# EAGLE schematic control_board_v006_Rev6 (EAGLE 6.6.0)
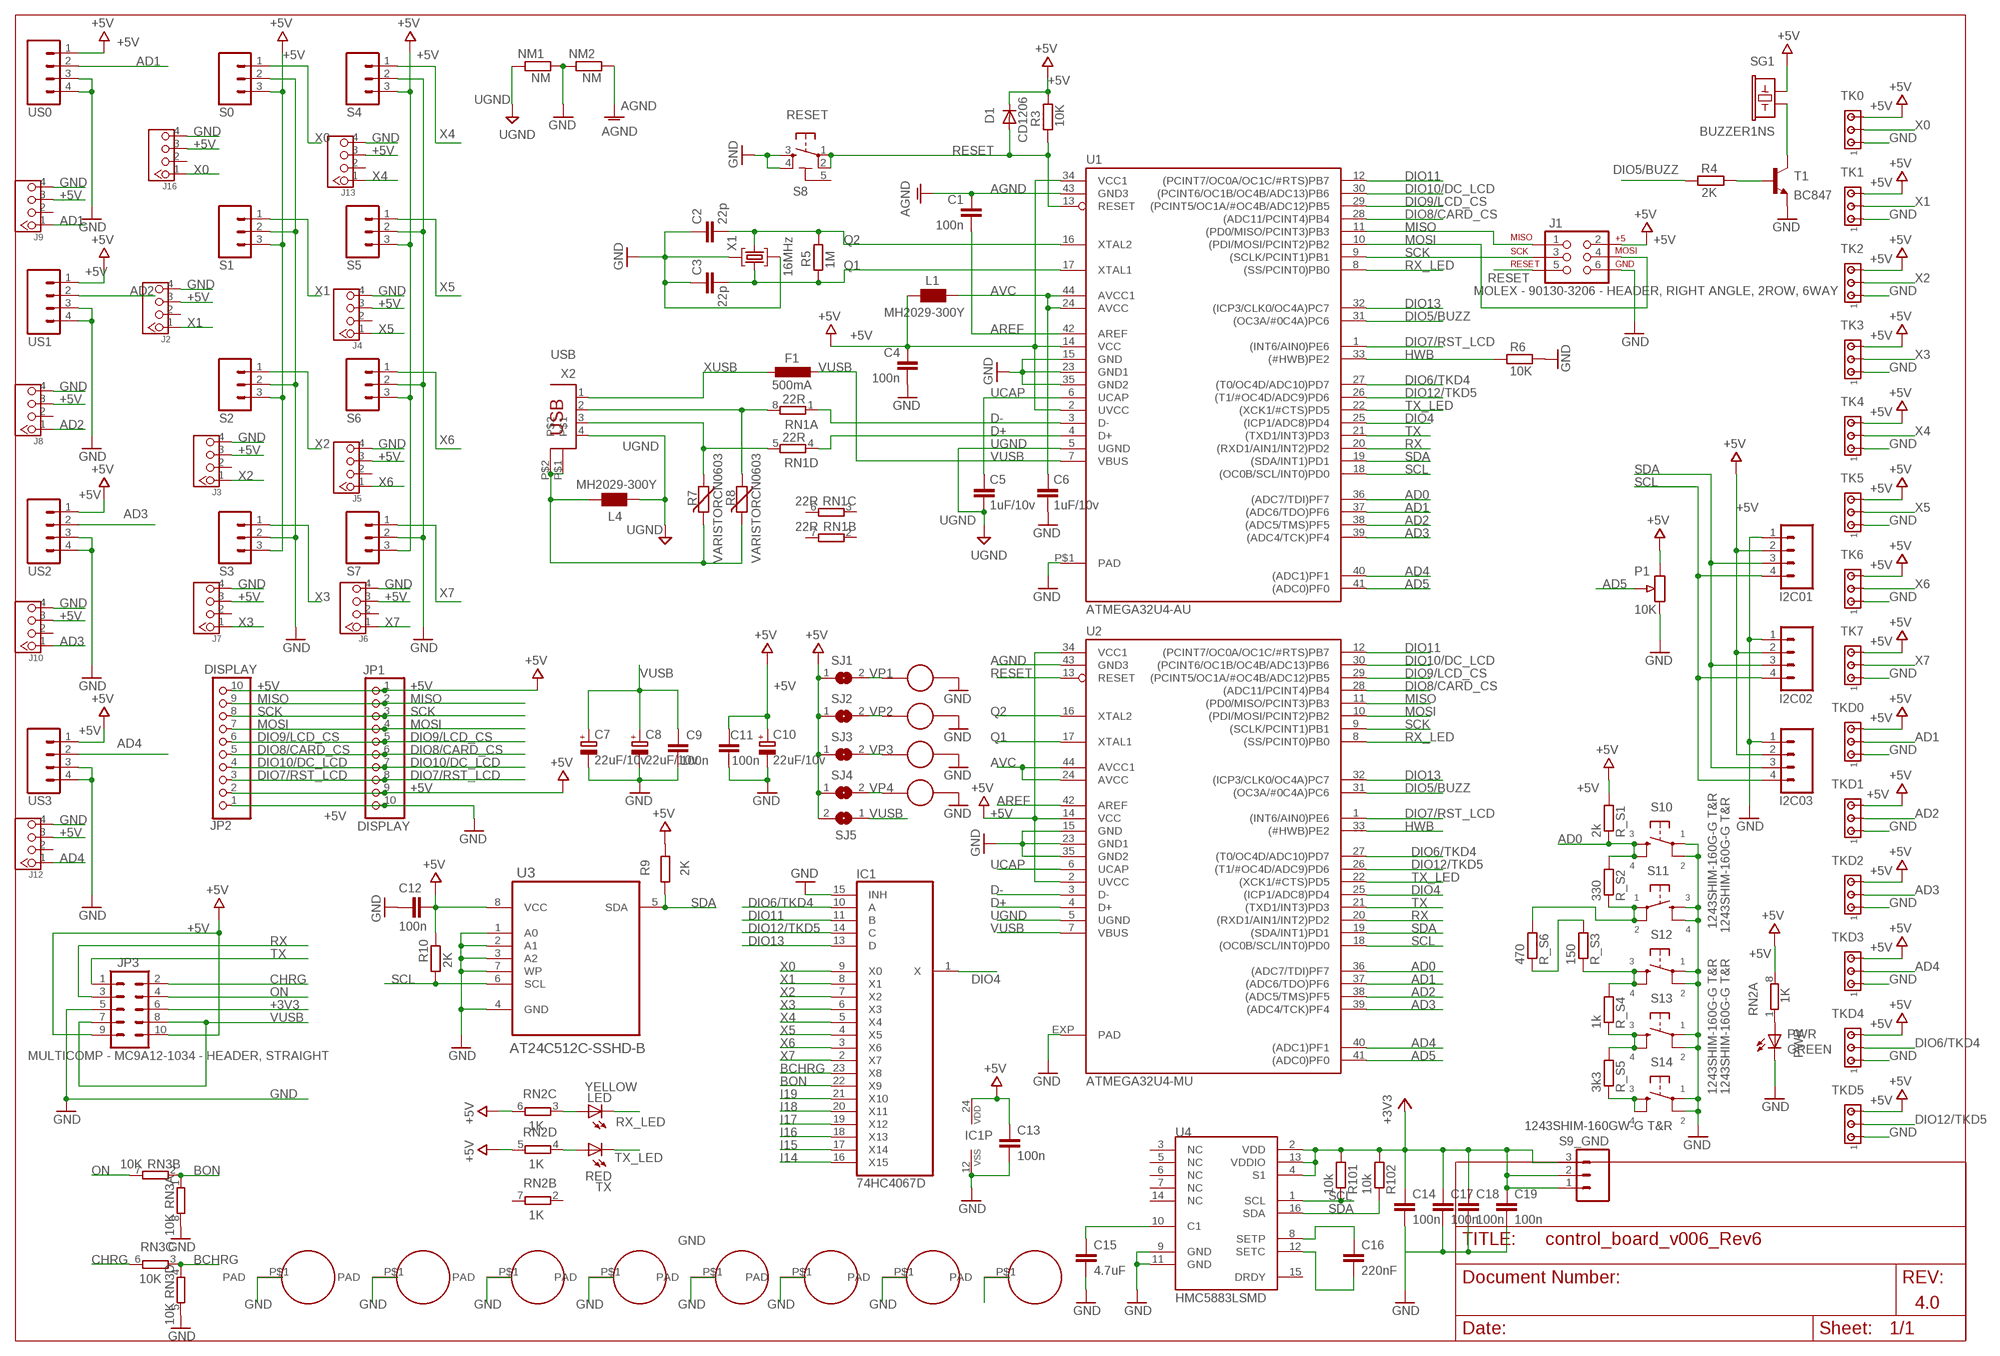
[diagram p0: schematic, sheet 1]

## Parts
C1  100n  C-EUC0603  [C0603-ROUND]
C2  22p  C-EUC0603  [C0603-ROUND]
C3  22p  C-EUC0603  [C0603-ROUND]
C4  100n  C-EUC0603  [C0603-ROUND]
C5  1uF/10v  C-EUC0603  [C0603-ROUND]
C6  1uF/10v  C-EUC0603  [C0603-ROUND]
C7  22uF/10v  CPOL-EUSMCB  [SMC_B]
C8  22uF/10v  CPOL-EUSMCB  [SMC_B]
C9  100n  C-EUC0603  [C0603-ROUND]
C10  22uF/10v  CPOL-EUSMCB  [SMC_B]
C11  100n  C-EUC0603  [C0603-ROUND]
C12  100n  C-EUC0603  [C0603-ROUND]
C13  100n  C-EUC0603  [C0603-ROUND]
C14  100n  C-EUC0603  [C0603-ROUND]
C15  4.7uF  C-EUC0603  [C0603-ROUND]
C16  220nF  C-EUC0603  [C0603-ROUND]
C17  100n  C-EUC0603  [C0603-ROUND]
C18  100n  C-EUC0603  [C0603-ROUND]
C19  100n  C-EUC0603  [C0603-ROUND]
D1  CD1206  DIODE-MINIMELF  [MINIMELF]
F1  500mA  L-EUL1812  [L1812]
H1  2.5-MOUNTING-HOLE  [2.5PAD]
H2  2.5-MOUNTING-HOLE  [2.5PAD]
H3  2.5-MOUNTING-HOLE  [2.5PAD]
H4  2.5-MOUNTING-HOLE  [2.5PAD]
H5  2.5-MOUNTING-HOLE  [2.5PAD]
H6  2.5-MOUNTING-HOLE  [2.5PAD]
H7  2.5-MOUNTING-HOLE  [2.5PAD]
H8  2.5-MOUNTING-HOLE  [2.5PAD]
I2C01  M04PTH  [1X04]
I2C02  M04PTH  [1X04]
I2C03  M04PTH  [1X04]
IC1  74HC4067D  4067D  [SO24W]
J1  MOLEX - 90130-3206 - HEADER, RIGHT ANGLE, 2ROW, 6WAY  AVR_SPI_PRG_6PTH  [2X3]
J2  TWIG-4P-2.0-2.0  [4P-2.0]
J3  TWIG-4P-2.0-2.0  [4P-2.0]
J4  TWIG-4P-2.0-2.0  [4P-2.0]
J5  TWIG-4P-2.0-2.0  [4P-2.0]
J6  TWIG-4P-2.0-2.0  [4P-2.0]
J7  TWIG-4P-2.0-2.0  [4P-2.0]
J8  TWIG-4P-2.0-2.0  [4P-2.0]
J9  TWIG-4P-2.0-2.0  [4P-2.0]
J10  TWIG-4P-2.0-2.0  [4P-2.0]
J12  TWIG-4P-2.0-2.0  [4P-2.0]
J13  TWIG-4P-2.0-2.0  [4P-2.0]
J16  TWIG-4P-2.0-2.0  [4P-2.0]
JP1  DISPLAY  PINHD-1X10TH  [1X10-TH]
JP2  DISPLAY  PINHD-1X10TH  [1X10-TH]
JP3  MULTICOMP - MC9A12-1034 - HEADER, STRAIGHT  M05X2SHD_LOCK  [2X5-SHROUDED_LOCK]
L1  MH2029-300Y  WE-CBF_0805  [0805]
L4  MH2029-300Y  WE-CBF_0805  [0805]
LED  YELLOW  LEDCHIP-LED0805  [CHIP-LED0805]
NM1  NM  R-EU_R0805  [R0805]
NM2  NM  R-EU_R0805  [R0805]
P1  10K  POT-VERTICAL  [POT-V]
PTZ1  LOTTIE_LEMON_PADS_SUP  [PADS_LOTTIE_LEMON_SUP]
PTZ2  LOTTIE_LEMON_PADS_SUP  [PADS_LOTTIE_LEMON_SUP]
PTZ3  LOTTIE_LEMON_PADS_SUP1  [PADS_LOTTIE_LEMON_SUP]
PTZ4  LOTTIE_LEMON_PADS_SUP1  [PADS_LOTTIE_LEMON_SUP]
PWR  PWR  LEDCHIP-LED0805  [CHIP-LED0805]
R3  10K  R-EU_R0603  [R0603-ROUND]
R4  2K  R-EU_R0603  [R0603-ROUND]
R5  1M  R-EU_R0603  [R0603-ROUND]
R6  10K  R-EU_R0603  [R0603-ROUND]
R7  VARISTORCN0603  [CT/CN0603]
R8  VARISTORCN0603  [CT/CN0603]
R9  2K  R-EU_R0603  [R0603-ROUND]
R10  2K  R-EU_R0603  [R0603-ROUND]
R101  10k  R-EU_R0603  [R0603-ROUND]
R102  10k  R-EU_R0603  [R0603-ROUND]
R_S1  2k  R-EU_R0603  [R0603-ROUND]
R_S2  330  R-EU_R0603  [R0603-ROUND]
R_S3  150  R-EU_R0603  [R0603-ROUND]
R_S4  1k  R-EU_R0603  [R0603-ROUND]
R_S5  3k3  R-EU_R0603  [R0603-ROUND]
R_S6  470  R-EU_R0603  [R0603-ROUND]
RN1  22R  4R-NCAY16  [CAY16]
RN2  1K  4R-NCAY16  [CAY16]
RN3  10K  4R-NCAY16  [CAY16]
S0  M03PTH  [1X03]
S1  M03PTH  [1X03]
S2  M03PTH  [1X03]
S3  M03PTH  [1X03]
S4  M03PTH  [1X03]
S5  M03PTH  [1X03]
S6  M03PTH  [1X03]
S7  M03PTH  [1X03]
S8  RESET  TS42  [TS42]
S9_GND  M03PTH  [1X03]
S10  1243SHIM-160G-G T&R  TACTILE_SWITCHTACTILE_SWITCH_SMD-12MM  [TACTILE-SMD-12MM]
S11  1243SHIM-160G-G T&R  TACTILE_SWITCHTACTILE_SWITCH_SMD-12MM  [TACTILE-SMD-12MM]
S12  1243SHIM-160G-G T&R  TACTILE_SWITCHTACTILE_SWITCH_SMD-12MM  [TACTILE-SMD-12MM]
S13  1243SHIM-160G-G T&R  TACTILE_SWITCHTACTILE_SWITCH_SMD-12MM  [TACTILE-SMD-12MM]
S14  1243SHIM-160GW-G T&R  TACTILE_SWITCHTACTILE_SWITCH_SMD-12MM  [TACTILE-SMD-12MM]
SG1  BUZZER1NS  [BUZZER-12MM-NS]
SJ1  SJ  [SJ]
SJ2  SJ  [SJ]
SJ3  SJ  [SJ]
SJ4  SJ  [SJ]
SJ5  SJL  [SJL]
T1  BC847  [SOT23]
TK0  MTA03-100  [10X03MTA]
TK1  MTA03-100  [10X03MTA]
TK2  MTA03-100  [10X03MTA]
TK3  MTA03-100  [10X03MTA]
TK4  MTA03-100  [10X03MTA]
TK5  MTA03-100  [10X03MTA]
TK6  MTA03-100  [10X03MTA]
TK7  MTA03-100  [10X03MTA]
TKD0  MTA03-100  [10X03MTA]
TKD1  MTA03-100  [10X03MTA]
TKD2  MTA03-100  [10X03MTA]
TKD3  MTA03-100  [10X03MTA]
TKD4  MTA03-100  [10X03MTA]
TKD5  MTA03-100  [10X03MTA]
TX  RED  LEDCHIP-LED0805  [CHIP-LED0805]
U1  ATMEGA32U4-AU  ATMEGA32U4-XUAU  [TQFP44-PAD]
U2  ATMEGA32U4-MU  ATMEGA32U4-XUMU  [QFN44ML7X7]
U3  AT24C512C-SSHD-B  AT24C128BN-SH-B  [SOIC127P600X175-8N]
U4  HMC5883LSMD  [16LPCC]
U$2  COMPLUBOT_LOTTIE_LEMON_BASE_TYPE002  [COMPLUBOT_BASE_ROBOT_002]
US0  M04PTH  [1X04]
US1  M04PTH  [1X04]
US2  M04PTH  [1X04]
US3  M04PTH  [1X04]
X1  16MHz  CRYSTAL-3.2-2.5  [CRYSTAL-3.2-2.5]
X2  USB  PN61729  [PN61729]

## Nets
+3V3: C14.1 C17.1 C18.1 C19.1 JP3.6 R101.2 R102.2 S9_GND.1 S9_GND.2 S9_GND.3 U4.2(VDD) U4.4(S1) U4.13(VDDIO)
+5V: C4.1 C10.+ C11.1 C12.1 C13.1 D1.C I2C01.2 I2C02.2 I2C03.2 IC1.24(VDD) J1.2 J2.3 J3.3 J4.3 J5.3 J6.3 J7.3 J8.3 J9.3 J10.3 J12.3 J13.3 J16.3 JP1.1 JP1.9 JP2.2 JP2.10 JP3.9 JP3.10 L1.2 P1.B R3.1 R9.2 R10.1 R_S1.2 RN2.5 RN2.6 RN2.8 S0.3 S1.3 S2.3 S3.3 S4.3 S5.3 S6.3 S7.3 SG1.+ SJ1.1 SJ2.1 SJ3.1 SJ4.1 SJ5.2 TK0.3 TK1.3 TK2.3 TK3.3 TK4.3 TK5.3 TK6.3 TK7.3 TKD0.3 TKD1.3 TKD2.3 TKD3.3 TKD4.3 TKD5.3 U1.2(UVCC) U1.14(VCC) U1.34(VCC1) U2.2(UVCC) U2.14(VCC) U2.34(VCC1) U3.8(VCC) US0.1 US1.1 US2.1 US3.1
AD0: R_S1.1 R_S2.2 S10.P$3 S10.P$4 U1.36((ADC7/TDI)PF7) U2.36((ADC7/TDI)PF7)
AD1: J9.1 TKD0.2 U1.37((ADC6/TDO)PF6) U2.37((ADC6/TDO)PF6) US0.2
AD2: J8.1 TKD1.2 U1.38((ADC5/TMS)PF5) U2.38((ADC5/TMS)PF5) US1.2
AD3: J10.1 TKD2.2 U1.39((ADC4/TCK)PF4) U2.39((ADC4/TCK)PF4) US2.2
AD4: J12.1 TKD3.2 U1.40((ADC1)PF1) U2.40((ADC1)PF1) US3.2
AD5: P1.C U1.41((ADC0)PF0) U2.41((ADC0)PF0)
AGND: C1.1 NM2.1 U1.43(GND3) U2.43(GND3)
AREF: C1.2 U1.42(AREF) U2.42(AREF)
AVC: C6.1 L1.1 U1.24(AVCC) U1.44(AVCC1) U2.24(AVCC) U2.44(AVCC1)
BCHRG: IC1.23(X8) RN3.3 RN3.4
BON: IC1.22(X9) RN3.1 RN3.2
CHRG: JP3.2 RN3.6
D+: RN1.4 U1.4(D+) U2.4(D+)
D-: RN1.1 U1.3(D-) U2.3(D-)
DIO4: IC1.1(X) U1.25((ICP1/ADC8)PD4) U2.25((ICP1/ADC8)PD4)
DIO5/BUZZ: R4.2 U1.31((OC3A/#0C4A)PC6) U2.31((OC3A/#0C4A)PC6)
DIO6/TKD4: IC1.10(A) TKD4.2 U1.27((T0/OC4D/ADC10)PD7) U2.27((T0/OC4D/ADC10)PD7)
DIO7/RST_LCD: JP1.8 JP2.3 U1.1((INT6/AIN0)PE6) U2.1((INT6/AIN0)PE6)
DIO8/CARD_CS: JP1.6 JP2.5 U1.28((ADC11/PCINT4)PB4) U2.28((ADC11/PCINT4)PB4)
DIO9/LCD_CS: JP1.5 JP2.6 U1.29((PCINT5/OC1A/#OC4B/ADC12)PB5) U2.29((PCINT5/OC1A/#OC4B/ADC12)PB5)
DIO10/DC_LCD: JP1.7 JP2.4 U1.30((PCINT6/OC1B/OC4B/ADC13)PB6) U2.30((PCINT6/OC1B/OC4B/ADC13)PB6)
DIO11: IC1.11(B) U1.12((PCINT7/OC0A/OC1C/#RTS)PB7) U2.12((PCINT7/OC0A/OC1C/#RTS)PB7)
DIO12/TKD5: IC1.14(C) TKD5.2 U1.26((T1/#OC4D/ADC9)PD6) U2.26((T1/#OC4D/ADC9)PD6)
DIO13: IC1.13(D) U1.32((ICP3/CLK0/OC4A)PC7) U2.32((ICP3/CLK0/OC4A)PC7)
GND: C2.1 C3.1 C4.2 C6.2 C7.- C8.- C9.2 C10.- C11.2 C12.2 C13.2 C14.2 C15.2 C17.2 C18.2 C19.2 H1.P$1(PAD) H2.P$1(PAD) H3.P$1(PAD) H4.P$1(PAD) H5.P$1(PAD) H6.P$1(PAD) H7.P$1(PAD) H8.P$1(PAD) I2C01.1 I2C02.1 I2C03.1 IC1.12(VSS) IC1.15(INH) J1.6 J2.4 J3.4 J4.4 J5.4 J6.4 J7.4 J8.4 J9.4 J10.4 J12.4 J13.4 J16.4 JP1.10 JP2.1 JP3.5 NM1.1 NM2.2 P1.A PTZ1.P$52 PTZ2.P$52 PTZ3.P$52 PTZ4.P$52 PWR.C R6.1 RN3.5 RN3.8 S0.2 S1.2 S2.2 S3.2 S4.2 S5.2 S6.2 S7.2 S8.3 S8.4 S10.P$1 S10.P$2 S11.P$3 S11.P$4 S12.P$1 S12.P$2 S13.P$1 S13.P$2 S14.P$1 S14.P$2 T1.2(E) TK0.1 TK1.1 TK2.1 TK3.1 TK4.1 TK5.1 TK6.1 TK7.1 TKD0.1 TKD1.1 TKD2.1 TKD3.1 TKD4.1 TKD5.1 U1.15(GND) U1.23(GND1) U1.35(GND2) U1.P$1(PAD) U2.15(GND) U2.23(GND1) U2.35(GND2) U2.EXP(PAD) U3.1(A0) U3.2(A1) U3.3(A2) U3.4(GND) U3.7(WP) U4.9(GND) U4.11(GND) US0.3 US0.4 US1.3 US1.4 US2.3 US2.4 US3.3 US3.4 X1.2(GND) X1.4(GND)
HWB: R6.2 U1.33((#HWB)PE2) U2.33((#HWB)PE2)
I14: IC1.16(X15)
I15: IC1.17(X14)
I16: IC1.18(X13)
I17: IC1.19(X12)
I18: IC1.20(X11)
I19: IC1.21(X10)
MISO: J1.1 JP1.2 JP2.9 U1.11((PD0/MISO/PCINT3)PB3) U2.11((PD0/MISO/PCINT3)PB3)
MOSI: J1.4 JP1.4 JP2.7 U1.10((PDI/MOSI/PCINT2)PB2) U2.10((PDI/MOSI/PCINT2)PB2)
N$1: C16.1 U4.8(SETP)
N$2: R8.1 RN1.8 X2.2
N$3: R7.1 RN1.5 X2.3
N$4: RN2.4 TX.A
N$5: R_S3.2 R_S6.1
N$6: C16.2 U4.12(SETC)
N$7: C15.1 U4.10(C1)
N$12: L4.1 R7.2 R8.2 X2.P$1 X2.P$2
N$13: R_S2.1 R_S6.2 S11.P$1 S11.P$2
N$14: LED.A RN2.3
N$17: SG1.- T1.3(C)
N$24: PWR.A RN2.1
N$27: R_S3.1 R_S4.2 S12.P$3 S12.P$4
N$29: R_S4.1 R_S5.2 S13.P$3 S13.P$4
N$30: R_S5.1 S14.P$3 S14.P$4
N$31: R4.1 T1.1(B)
ON: JP3.4 RN3.7
Q1: C3.2 R5.2 U1.17(XTAL1) U2.17(XTAL1) X1.1(C1)
Q2: C2.2 R5.1 U1.16(XTAL2) U2.16(XTAL2) X1.3(C2)
RESET: D1.A J1.5 R3.2 S8.1 S8.2 U1.13(RESET) U2.13(RESET)
RX: JP3.3 U1.20((RXD1/AIN1/INT2)PD2) U2.20((RXD1/AIN1/INT2)PD2)
RX_LED: LED.C U1.8((SS/PCINT0)PB0) U2.8((SS/PCINT0)PB0)
SCK: J1.3 JP1.3 JP2.8 U1.9((SCLK/PCINT1)PB1) U2.9((SCLK/PCINT1)PB1)
SCL: I2C01.4 I2C02.4 I2C03.4 R10.2 R101.1 U1.18((OC0B/SCL/INT0)PD0) U2.18((OC0B/SCL/INT0)PD0) U3.6(SCL) U4.1(SCL)
SDA: I2C01.3 I2C02.3 I2C03.3 R9.1 R102.1 U1.19((SDA/INT1)PD1) U2.19((SDA/INT1)PD1) U3.5(SDA) U4.16(SDA)
TX: JP3.1 U1.21((TXD1/INT3)PD3) U2.21((TXD1/INT3)PD3)
TX_LED: TX.C U1.22((XCK1/#CTS)PD5) U2.22((XCK1/#CTS)PD5)
UCAP: C5.1 U1.6(UCAP) U2.6(UCAP)
UGND: C5.2 L4.2 NM1.2 U1.5(UGND) U2.5(UGND) X2.4
VP1: PTZ3.P$42 SJ1.2
VP2: PTZ4.P$42 SJ2.2
VP3: PTZ1.P$42 SJ3.2
VP4: PTZ2.P$42 SJ4.2
VUSB: C7.+ C8.+ C9.1 F1.2 JP3.7 JP3.8 SJ5.1 U1.7(VBUS) U2.7(VBUS)
X0: IC1.9(X0) J16.1 S0.1 TK0.2
X1: IC1.8(X1) J2.1 S1.1 TK1.2
X2: IC1.7(X2) J3.1 S2.1 TK2.2
X3: IC1.6(X3) J7.1 S3.1 TK3.2
X4: IC1.5(X4) J13.1 S4.1 TK4.2
X5: IC1.4(X5) J4.1 S5.1 TK5.2
X6: IC1.3(X6) J5.1 S6.1 TK6.2
X7: IC1.2(X7) J6.1 S7.1 TK7.2
XUSB: F1.1 X2.1
Unconnected: J2.2 J3.2 J4.2 J5.2 J6.2 J7.2 J8.2 J9.2 J10.2 J12.2 J13.2 J16.2 RN1.2 RN1.3 RN1.6 RN1.7 RN2.2 RN2.7 U4.3(NC) U4.5(NC) U4.6(NC) U4.7(NC) U4.14(NC) U4.15(DRDY)

## Notes on the sheet
- GREEN
- 4.0

## Power pins joined to a net without a drawn wire
5-GND: S8.5(5-GND)

## Library data of the parts
C1-C6 C9 C11-C19 = Smartprj:C-EU: CAPACITOR, European symbol
C7 C8 C10 = Smartprj:CPOL-EU: POLARIZED CAPACITOR, European symbol
D1 = diode:DIODE-: DIODE
F1 = rcl:L-EU: INDUCTOR, European symbol
H1-H8 = tinker_it:2.5-MOUNTING-HOLE
I2C01-I2C03 US0 US1-US3 = sparkfun:M04: Header 4 Standard 4-pin 0.1" header. Use with straight break away headers (SKU : PRT-00116), right angle break away headers (PRT-00553), swiss pins (PRT-00743), machine pins (PRT-00117), and female headers (PRT-00115). Molex polarized connector foot print use with SKU : PRT-08231 with associated crimp pins and housings. 1MM SMD Version SKU: PRT-10208
IC1 = 40xx:4067: 16-channel ANALOG MULTIPLEXER
J1 = sparkfun:AVR_SPI_PRG_6: AVR ISP 6 Pin This is the reduced ISP connector for AVR programming. Common on Arduino. This footprint will take up less PCB space and can be used with a 10-pin to 6-pin adapter such as SKU: BOB-08508
J2-J10 J12 J13 J16 = SeeedStudio-Connector:TWIG-4P-2.0
JP1 JP2 = Smartprj:PINHD-1X10: PIN HEADER
JP3 = Smartprj:M05X2: Header 5x2 Standard 10-pin dual row 0.1" header. Commonly used with AVR-ISP. Use with Spark Fun Electronics SKU: PRT-00778
L1 L4 = wuerth-elektronik:WE-CBF: SMD EMI Suppression Ferrite Beads - excellent anti-EMI properties - low DCR - impedances till 3000 ohms - rated current up to 6 A
LED PWR TX = led:LED: LED OSRAM: - CHIPLED LG R971, LG N971, LY N971, LG Q971, LY Q971, LO R971, LY R971 LH N974, LH R974 LS Q976, LO Q976, LY Q976 LO Q996 - Hyper CHIPLED LW Q18S LB Q993, LB Q99A, LB R99A - SideLED LS A670, LO A670, LY A670, LG A670, LP A670 LB A673, LV A673, LT A673, LW A673 LH A674 LY A675 LS A676, LA A676, LO A676, LY A676, LW A676 LS A679, LY A679, LG A679 - Hyper Micro SIDELED® LS Y876, LA Y876, LO Y876, LY Y876 LT Y87S - SmartLED LW L88C, LW L88S LB L89C, LB L89S, LG L890 LS L89K, LO L89K, LY L89K LS L896, LA L896, LO L896, LY L896 - TOPLED LS T670, LO T670, LY T670, LG T670, LP T670 LSG T670, LSP T670, LSY T670, LOP T670, LYG T670 LG T671, LOG T671, LSG T671 LB T673, LV T673, LT T673, LW T673 LH T674 LS T676, LA T676, LO T676, LY T676, LB T676, LH T676, LSB T676, LW T676 LB T67C, LV T67C, LT T67C, LS T67K, LO T67K, LY T67K, LW E67C LS E67B, LA E67B, LO E67B, LY E67B, LB E67C, LV E67C, LT E67C LW T67C LS T679, LY T679, LG T679 LS T770, LO T770, LY T770, LG T770, LP T770 LB T773, LV T773, LT T773, LW T773 LH T774 LS E675, LA E675, LY E675, LS T675 LS T776, LA T776, LO T776, LY T776, LB T776 LHGB T686 LT T68C, LB T68C - Hyper Mini TOPLED® LB M676 - Mini TOPLED Santana® LG M470 LS M47K, LO M47K, LY M47K Source: http://www.osram.convergy.de LUXEON: - LUMILED® LXK2-PW12-R00, LXK2-PW12-S00, LXK2-PW14-U00, LXK2-PW14-V00 LXK2-PM12-R00, LXK2-PM12-S00, LXK2-PM14-U00 LXK2-PE12-Q00, LXK2-PE12-R00, LXK2-PE12-S00, LXK2-PE14-T00, LXK2-PE14-U00 LXK2-PB12-K00, LXK2-PB12-L00, LXK2-PB12-M00, LXK2-PB14-N00, LXK2-PB14-P00, LXK2-PB14-Q00 LXK2-PR12-L00, LXK2-PR12-M00, LXK2-PR14-Q00, LXK2-PR14-R00 LXK2-PD12-Q00, LXK2-PD12-R00, LXK2-PD12-S00 LXK2-PH12-R00, LXK2-PH12-S00 LXK2-PL12-P00, LXK2-PL12-Q00, LXK2-PL12-R00 Source: www.luxeon.com KINGBRIGHT: KA-3528ASYC Source: www.kingbright.com
NM1 NM2 = resistor:R-EU_: RESISTOR, European symbol
P1 = Smartprj:POT-VERTICAL: Vertical POT TinkerKit
PTZ1 PTZ2 = Lottie_SPad2:LOTTIE_LEMON_PADS_SUP
PTZ3 PTZ4 = Lottie_SPad:LOTTIE_LEMON_PADS_SUP1
R3-R6 R9 R10 R101 R102 R_S1-R_S6 = Smartprj:R-EU_: RESISTOR, European symbol
R7 R8 = varistor:VARISTOR: VARISTOR
RN1-RN3 = resistor-dil:4R-N: Array Chip Resistor Source: RS Component / Phycomp; OC_FARNELL: unknown; OC_NEWARK: unknown
S0 S1-S7 S9_GND = sparkfun:M03: Header 3 Standard 3-pin 0.1" header. Use with straight break away headers (SKU : PRT-00116), right angle break away headers (PRT-00553), swiss pins (PRT-00743), machine pins (PRT-00117), and female headers (PRT-00115). Molex polarized connector foot print use with SKU : PRT-08232 with associated crimp pins and housings.
S8 = Smartprj:TS42: TS42 Dongnan Electronics Tact switch VDC 12V - 50mA
S10-S14 = Smartprj:TACTILE_SWITCH: Momentary Switch Button commonly used for reset or general input.
SG1 = Smartprj:BUZZER1: Buzzer 12-22mm Spark Fun Electronics SKU : Comp-Buzzer
SJ1-SJ5 = Smartprj:SJ: SMD solder JUMPER
T1 = transistor:BC847: NPN TRANSISTOR
TK0 TK1-TK7 TKD0 TKD1-TKD5 = con-amp:MTA03-100: AMP connector
U1 U2 = Smartprj:ATMEGA32U4-XU
U3 = Smartprj:AT24C128BN-SH-B: Two-wire Serial EEPROM; MPN: AT24C128BN-SH-B; OC_FARNELL: 1362649; OC_NEWARK: 50M3322; PACKAGE: SOIC-8; SUPPLIER: Atmel
U4 = sparkfun:HMC5883L: 3 Axis Digital Compass IC
U$2 = BoardRev5.2.b:COMPLUBOT_LOTTIE_LEMON_BASE_TYPE: Lottie Lemon Robot Base Lottie Lemon is two wheeled robot made of two PCBs. One contains the intelligence while the other carries the motors, their drivers, and line following sensors.
X1 = Smartprj:CRYSTAL-3.2-2.5
X2 = Smartprj:PN61729: BERG USB connector

## Net classes
1 power: width 0.254 mm, drill 0.584 mm, clearance 0.203 mm
2 gnd: width 0.254 mm, drill 0.584 mm, clearance 0.178 mm